# Altium project MiniHeating.PrjPcb
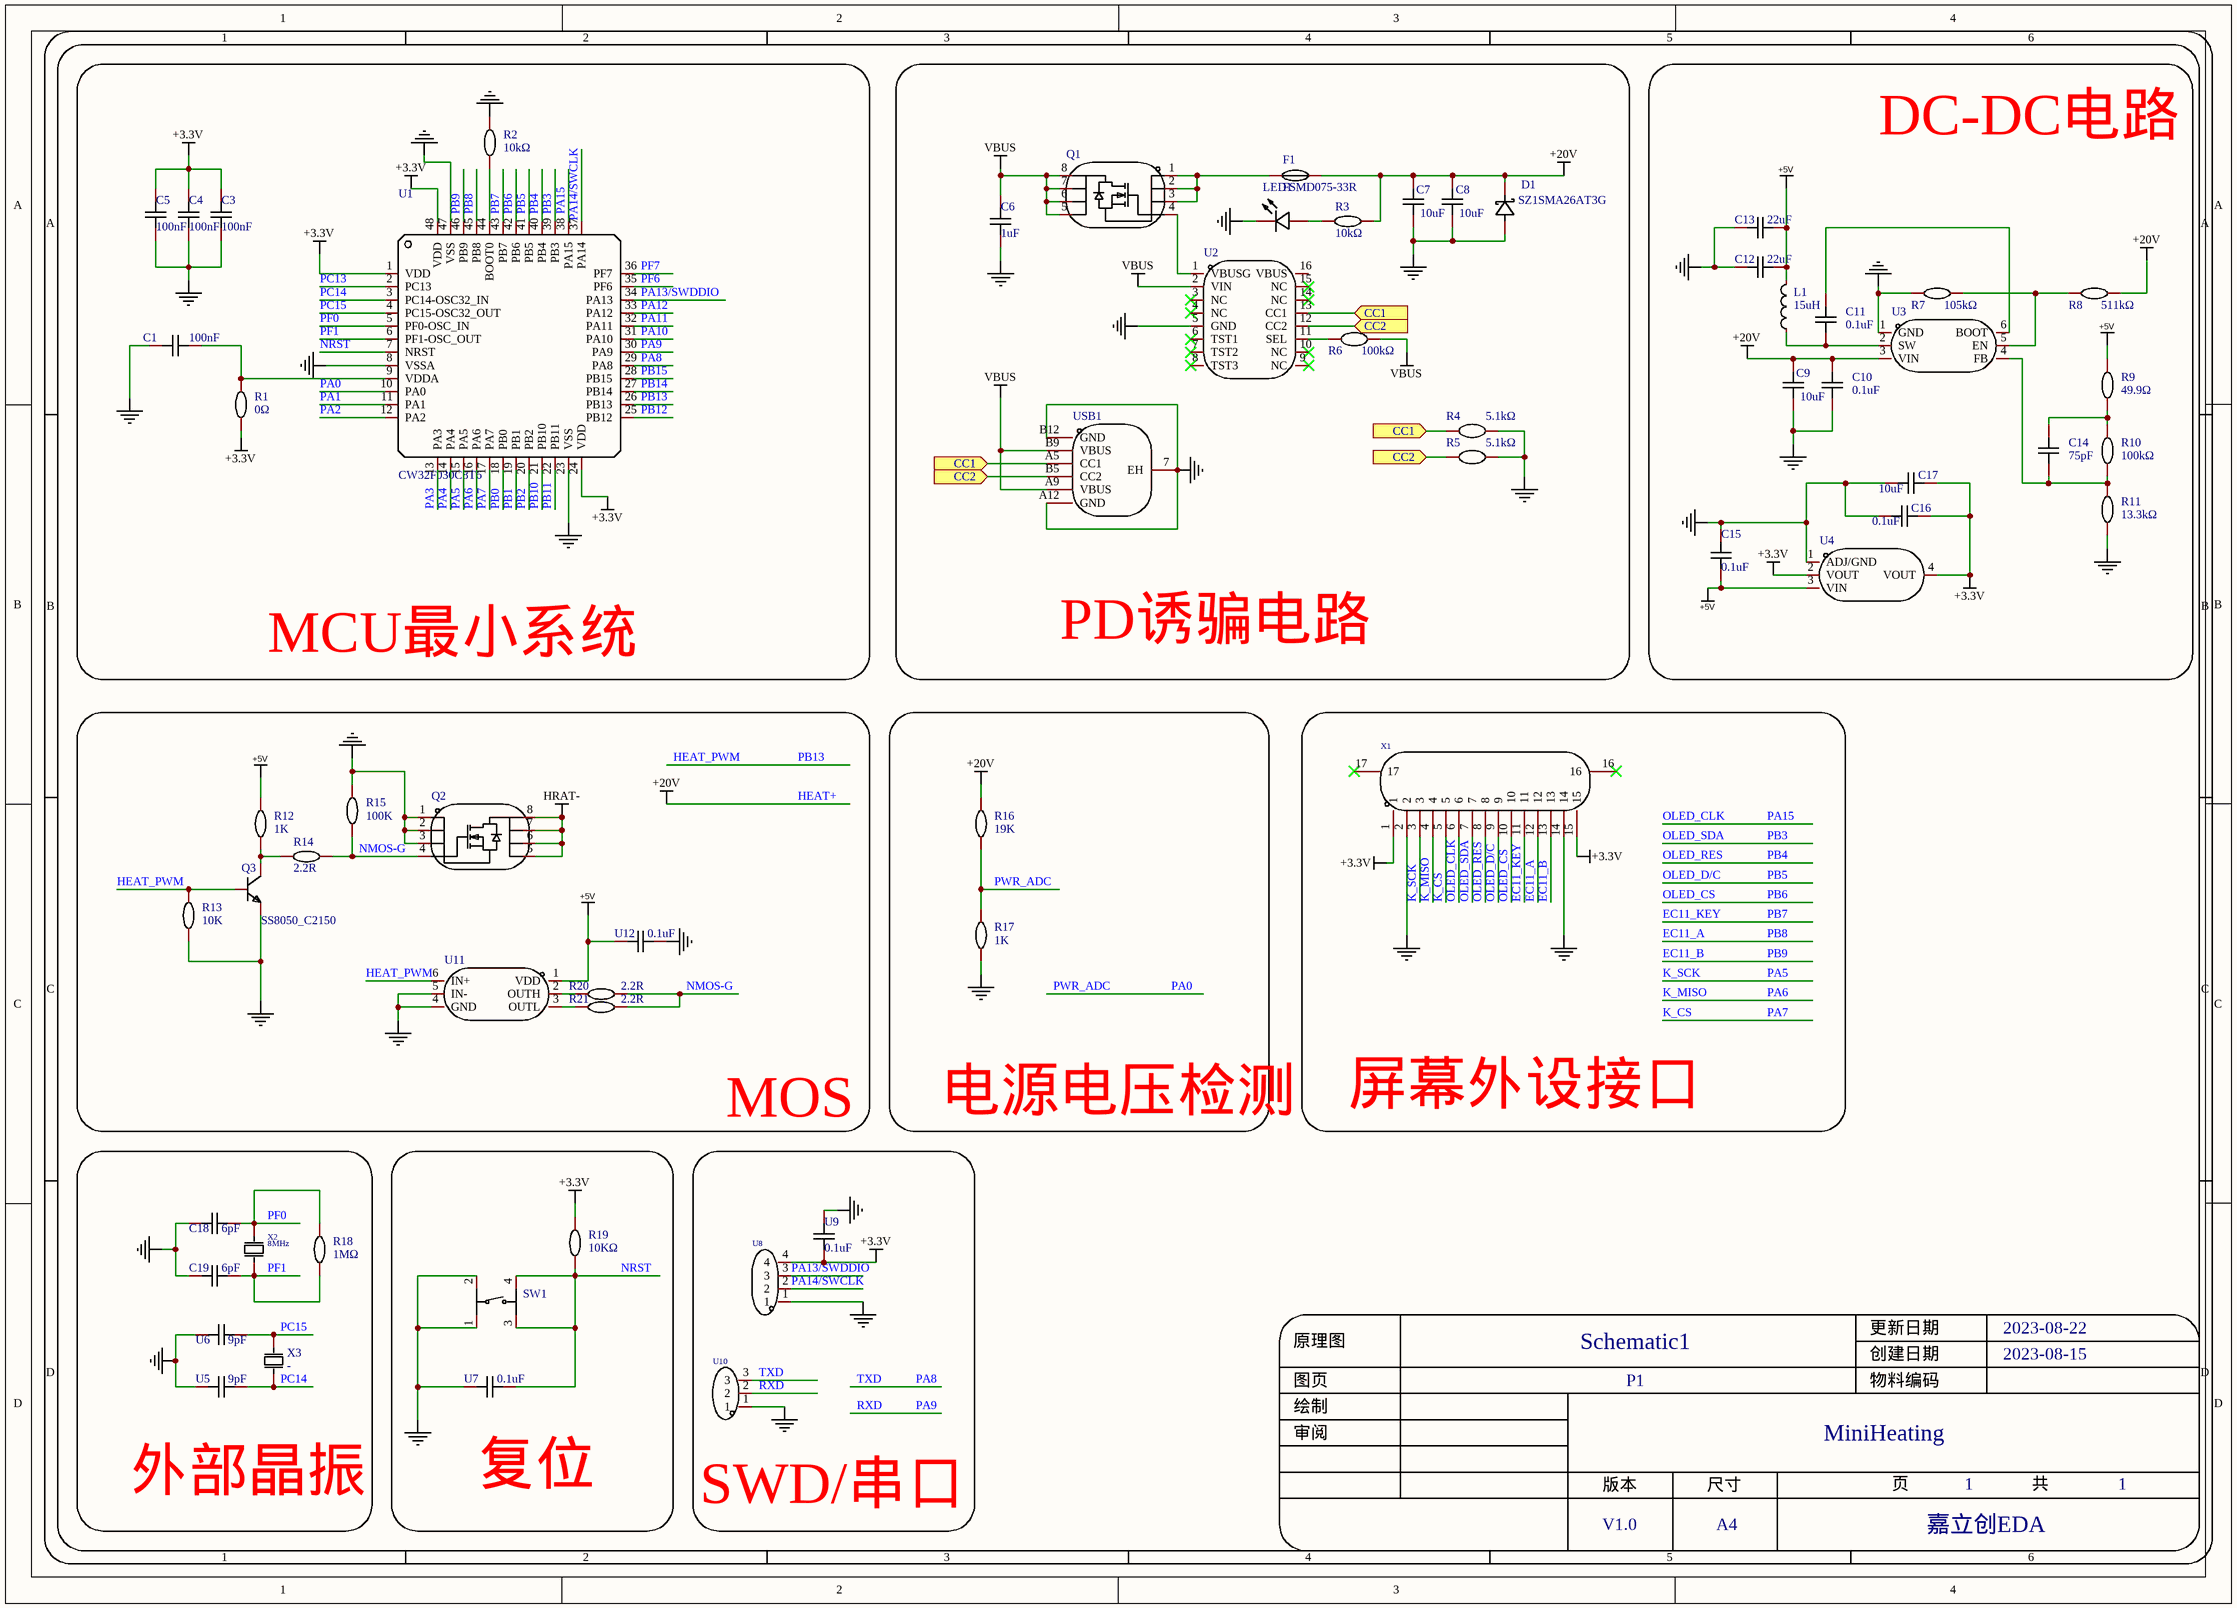
[diagram p0: MiniHeating.SchDoc]
1 sheet, 63 parts. Net scope: flat (ports and power ports of the same name join across sheets).
Board file: MiniHeating.PcbDoc

## Sheet MiniHeating.SchDoc
size 431 x 309 mm; Symbol: Sheet-Symbol_A4; Device: Sheet-Symbol_A4; @Page Name: P1; @Create Date: 2023-08-15; @Page Count: 1; @Page No: 1; @Project Name: MiniHeating; @Schematic Name: Schematic1; @Update Date: 2023-08-22; Company: 嘉立创EDA; Page Size: A4; Version: V1.0

### Parts
C1  value 100nF  [C0603]  (hidden comment: CC0603KRX7R9BB104)
C3  value 100nF  [C0603]  (hidden comment: CC0603KRX7R9BB104)
C4  value 100nF  [C0603]  (hidden comment: CC0603KRX7R9BB104)
C5  value 100nF  [C0603]  (hidden comment: CC0603KRX7R9BB104)
C6  value 1uF  [C0805]  (hidden comment: 10uF_C15415)
C7  10uF  [C0805]
C8  10uF  [C0805]
C9  10uF  [C0805]
C10  value 0.1uF  [C0603]  (hidden comment: 0603BB104K500NGT)
C11  value 0.1uF  [C0603]  (hidden comment: 0603BB104K500NGT)
C12  22uF  [C0805]
C13  22uF  [C0805]
C14  value 75pF  [C0603]  (hidden comment: 0603BB104K500NGT)
C15  value 0.1uF  [C0603]  (hidden comment: 0603BB104K500NGT)
C16  value 0.1uF  [C0603]  (hidden comment: 0603BB104K500NGT)
C17  10uF  [C0805]
C18  value 6pF  [C0603]  (hidden comment: CGA3E2C0G1H060DT0Y0N)
C19  value 6pF  [C0603]  (hidden comment: CGA3E2C0G1H060DT0Y0N)
D1  SZ1SMA26AT3G  [SMA_L4.3-W2.6-LS5.2-FD]
F1  FSMD075-33R  [F1812]
L1  value 15uH  [IND-SMD_L7.0-W6.6_FXL0630]  (hidden comment: FXL0630-150-M)
LED1  KT-0603R  [LED0603-RD]  (value not drawn)
Q1  BSC123N08NS3 G  [PG-TDSON-8_L5.0-W6.0-P1.27-BL-EP]  (value not drawn)
Q2  BSC123N08NS3 G  [PG-TDSON-8_L5.0-W6.0-P1.27-BL-EP]  (value not drawn)
Q3  SS8050_C2150  [SOT-23-3_L2.9-W1.3-P1.90-LS2.4-BR]
R1  value 0Ω  [R0603]  (hidden comment: 0603WAF4703T5E)
R2  value 10kΩ  [R0603]  (hidden comment: 0603WAF2402T5E)
R3  value 10kΩ  [R0603]  (hidden comment: RNCS0603BKE10K0)
R4  value 5.1kΩ  [R0603]  (hidden comment: AC0603DR-0710KL)
R5  value 5.1kΩ  [R0603]  (hidden comment: AC0603DR-0710KL)
R6  100kΩ  [R0603]
R7  value 105kΩ  [R0603]  (hidden comment: AC0603FR-07105KL)
R8  value 511kΩ  [R0603]  (hidden comment: AC0603FR-07105KL)
R9  value 49.9Ω  [R0603]  (hidden comment: AR03BTC5002A)
R10  value 100kΩ  [R0603]  (hidden comment: AR03BTC5002A)
R11  value 13.3kΩ  [R0603]  (hidden comment: AR03BTC5002A)
R12  value 1K  [R0603]  (hidden comment: 0603WAF4703T5E)
R13  value 10K  [R0603]  (hidden comment: 0603WAF4703T5E)
R14  value 2.2R  [R0603]  (hidden comment: 0603WAF4703T5E)
R15  value 100K  [R0603]  (hidden comment: 0603WAF4703T5E)
R16  value 19K  [R0603]  (hidden comment: 0603WAF4703T5E)
R17  value 1K  [R0603]  (hidden comment: 0603WAF4703T5E)
R18  value 1MΩ  [R0603]  (hidden comment: 0603WAF1004T5E)
R19  value 10KΩ  [R0603]  (hidden comment: 0603WAF1004T5E)
R20  value 2.2R  [R0603]  (hidden comment: 0603WAF4703T5E)
R21  value 2.2R  [R0603]  (hidden comment: 0603WAF4703T5E)
SW1  TS-1186D-C-A  [SW-SMD_TS-1186D-C-A]  (value not drawn)
U1  CW32F030C8T6  [LQFP-48_L7.0-W7.0-P0.50-LS9.0-TL]
U2  IP2721  [TSSOP-16_L5.0-W4.4-P0.65-LS6.4-BL]  (value not drawn)
U3  TPS54202DDCR  [SOT-23-6_L2.9-W1.6-P0.95-LS2.8-BL]  (value not drawn)
U4  LM1117GS-3.3  [SOT-223-3_L6.5-W3.4-P2.30-LS7.0-BR]  (value not drawn)
U5  value 9pF  [C0603]  (hidden comment: C1608C0G1H090D080AA)
U6  value 9pF  [C0603]  (hidden comment: C1608C0G1H090D080AA)
U7  value 0.1uF  [C0603]  (hidden comment: C1608C0G1H090D080AA)
U8  ZX-PZ2.54-1-4PWZ  [HDR-TH_4P-P2.54-H-M-W10.3]  (value not drawn)
U9  value 0.1uF  [C0603]  (hidden comment: C1608C0G1H090D080AA)
U10  ZX-PZ2.54-1-3PZZ  [HDR-TH_3P-P2.54-V-M-1]  (value not drawn)
U11  UCC27511DBVR  [SOT-23-6_L2.9-W1.6-P0.95-LS2.8-BL]  (value not drawn)
U12  value 0.1uF  [C0603]  (hidden comment: C1608C0G1H090D080AA)
USB1  TYPE-C-6P-DIP2X2  [TYPE-C-SMD_TYPE-C-6P]  (value not drawn)
X1  AFC01-S15FCA-00  [FPC-SMD_15P-P0.50_JS_AFC01-S15FCA-00]  (value not drawn)
X2  value 8MHz  [HC-49US_L11.5-W4.5-P4.88]  (hidden comment: TAXD8M2GLFBET2T)
X3  SF32WK32768D31T002  [OSC-SMD_L3.2-W1.5]  (value not drawn)

### Blocks framed on the sheet
MCU最小系统: C1 C3-C5 R1 R2 U1
PD诱骗电路: C6-C8 D1 F1 LED1 Q1 R3-R6 U2 USB1
DC-DC电路: C9-C17 L1 R7-R11 U3 U4
MOS: Q2 Q3 R12-R15 R20 R21 U11 U12
电源电压检测: R16 R17
屏幕外设接口: X1
外部晶振: C18 C19 R18 U5 U6 X2 X3
复位: R19 SW1 U7
SWD/串口: U8-U10

### Ports
CC1 (in), CC2 (in)

### Nets
+3.3V: C3.2 C4.2 C5.2 C16.1 C17.1 R1.1 R19.2 U1.1(VDD) U1.24(VDD) U1.48(VDD) U4.2(VOUT) U4.4(VOUT) U8.4 U9.1 X1.1 X1.15
+5V: C12.1 C13.1 C15.1 L1.2 R9.2 R12.2 U4.3(VIN) U11.1(VDD) U12.1
HEAT+: C7.2 C8.2 C9.2 C10.2 D1.2(K) F1.2 R3.1 R8.2 R16.2 U3.3(VIN)  [also labelled +20V]
HRAT-: Q2.5(D) Q2.6(D) Q2.7(D) Q2.8(D)
NetC1_1: C1.1 C3.1 C4.1 C5.1 C6.1 C7.1 C8.1 C9.1 C10.1 C12.2 C13.2 C15.2 C16.2 C17.2 C18.1 C19.1 D1.1(A) LED1.1(K) Q2.1(S) Q2.2(S) Q2.3(S) Q3.2(E) R2.2 R4.2 R5.2 R7.1 R11.1 R13.1 R15.2 R17.1 SW1.1 SW1.2 U1.8(VSSA) U1.23(VSS) U1.47(VSS) U2.5(GND) U3.1(GND) U4.1(ADJ/GND) U5.1 U6.1 U7.1 U8.1 U9.2 U10.1 U11.4(GND) U11.5(IN-) U12.2 USB1.7(EH) USB1.A12(GND) USB1.B12(GND) X1.2 X1.14
VBUS: C6.2 Q1.5(D) Q1.6(D) Q1.7(D) Q1.8(D) R6.2 U2.2(VIN) USB1.A9(VBUS) USB1.B9(VBUS)
EC11_A: U1.45(PB8) X1.12  [also labelled PB8]
EC11_B: U1.46(PB9) X1.13  [also labelled PB9]
EC11_KEY: U1.43(PB7) X1.11  [also labelled PB7]
HEAT_PWM: Q3.1(B) R13.2 U1.26(PB13) U11.6(IN+)  [also labelled PB13]
K_CS: U1.17(PA7) X1.5  [also labelled PA7]
K_MISO: U1.16(PA6) X1.4  [also labelled PA6]
K_SCK: U1.15(PA5) X1.3  [also labelled PA5]
NMOS-G: Q2.4(G) R14.1 R15.1 R20.1 R21.1
NRST: R19.1 SW1.3 SW1.4 U1.7(NRST) U7.2
OLED_CLK: U1.38(PA15) X1.6  [also labelled PA15]
OLED_CS: U1.42(PB6) X1.10  [also labelled PB6]
OLED_D/C: U1.41(PB5) X1.9  [also labelled PB5]
OLED_RES: U1.40(PB4) X1.8  [also labelled PB4]
OLED_SDA: U1.39(PB3) X1.7  [also labelled PB3]
PA0: R16.1 R17.2 U1.10(PA0)  [also labelled PWR_ADC]
PA1: U1.11(PA1)
PA2: U1.12(PA2)
PA3: U1.13(PA3)
PA4: U1.14(PA4)
PA8: U1.29(PA8) U10.3  [also labelled TXD]
PA9: U1.30(PA9) U10.2  [also labelled RXD]
PA10: U1.31(PA10)
PA11: U1.32(PA11)
PA12: U1.33(PA12)
PA13/SWDDIO: U1.34(PA13) U8.3
PA14/SWCLK: U1.37(PA14) U8.2
PB0: U1.18(PB0)
PB1: U1.19(PB1)
PB2: U1.20(PB2)
PB10: U1.21(PB10)
PB11: U1.22(PB11)
PB12: U1.25(PB12)
PB14: U1.27(PB14)
PB15: U1.28(PB15)
PC13: U1.2(PC13)
PC14: U1.3(PC14-OSC32_IN) U5.2 X3.1(OSC1)
PC15: U1.4(PC15-OSC32_OUT) U6.2 X3.2(OSC2)
PF0: C18.2 R18.2 U1.5(PF0-OSC_IN) X2.2(OSC2)
PF1: C19.2 R18.1 U1.6(PF1-OSC_OUT) X2.1(OSC1)
PF6: U1.35(PF6)
PF7: U1.36(PF7)
NetC1_2: C1.2 R1.2 U1.9(VDDA)
NetC11_1: C11.1 U3.6(BOOT)
NetC11_2: C11.2 L1.1 U3.2(SW)
NetC14_1: C14.1 R10.1 R11.2 U3.4(FB)
NetC14_2: C14.2 R9.1 R10.2
NetF1_1: F1.1 Q1.1(S) Q1.2(S) Q1.3(S)
NetLED1_2: LED1.2(A) R3.2
NetQ1_4: Q1.4(G) U2.1(VBUSG)
NetQ3_3: Q3.3(C) R12.1 R14.2
NetR2_1: R2.1 U1.44(BOOT0)
NetR4_1: R4.1 U2.13(CC1) USB1.A5(CC1) ; port CC1
NetR5_1: R5.1 U2.12(CC2) USB1.B5(CC2) ; port CC2
NetR6_1: R6.1 U2.11(SEL)
NetR7_2: R7.2 R8.1 U3.5(EN)
NetR20_2: R20.2 U11.2(OUTH)
NetR21_2: R21.2 U11.3(OUTL)

Not connected (* = marked no-connect by the designer): U2 3(NC)* 4(NC)* 6(TST1)* 7(TST2)* 8(TST3)* 9(NC)* 10(NC)* 14(NC)* 15(NC)* 16(VBUS); X1 16* 17*

### Notes on the sheet
- 1
- 2
- 3
- 4
- 5
- 6
- A
- B
- C
- D
- 原理图
- Schematic1
- 创建日期
- 更新日期
- 2023-08-15
- 2023-08-22
- 审阅
- 绘制
- 图页
- P1
- 物料编码
- MiniHeating
- 版本
- 尺寸
- 页
- 共
- V1.0
- A4
- 嘉立创EDA

### Library data of the parts
C1 C3-C5 = CC0603KRX7R9BB104: 容值:100nF;精度:±10%;额定电压:50V;材质(温度系数):X7R;; Manufacturer: YAGEO(国巨); Add into BOM: yes; Tolerance: ±10%; Voltage Rated: 50V; Temperature Coefficient: X7R; Name: 100nF; Symbol: CC0603KRX7R9BB104; Device: CC0603KRX7R9BB104; LCSC Part Name: 100nF ±10% 50V; Supplier Part: C14663; Manufacturer Part: CC0603KRX7R9BB104; Supplier Footprint: 0603; JLCPCB Part Class: 基础库; Datasheet: https://atta.szlcsc.com/upload/public/pdf/source/20180910/C282072_33301C7F631E79921B82A8DAC6BCC5B3.pdf; Supplier: LCSC; Convert to PCB: yes
C6 = 10uF_C15415: 容值:10uF;精度:±20%;额定电压:16V;材质(温度系数):-;; Manufacturer: SAMSUNG(三星); Symbol: 10UF; Add into BOM: yes; Tolerance: ±20%; Voltage Rated: 16V; Name: 1uF; Device: 10uF_C15415; LCSC Part Name: 10uF ±20% 16V; Supplier Part: C15415; Manufacturer Part: 10uF; Supplier Footprint: 0603; JLCPCB Part Class: 扩展库; Datasheet: https://atta.szlcsc.com/upload/public/pdf/source/20160103/1457707675960.pdf; Supplier: LCSC; Convert to PCB: yes; Temperature Coefficient: -
C7-C9 C12 C13 C17 = GRT21BC71E106KE13L: 容值:10uF;精度:±10%;额定电压:-;材质(温度系数):-;; Manufacturer: muRata(村田); Add into BOM: yes; Tolerance: ±10%; Symbol: GRT21BC71E106KE13L; Device: GRT21BC71E106KE13L; LCSC Part Name: 10uF ±10%; Supplier Part: C882505; Manufacturer Part: GRT21BC71E106KE13L; Supplier Footprint: 0805; JLCPCB Part Class: 扩展库; Datasheet: https://atta.szlcsc.com/upload/public/pdf/source/20201228/C882505_6C63D8D57C6472D033E3095FB59E12C2.pdf; Supplier: LCSC; Convert to PCB: yes; Voltage Rated: -; Temperature Coefficient: -
  C7-C9 C17: Name: 10uF; Value: 10uF
  C12 C13: Name: 22uF; Value: 22uF
C10 C11 C14-C16 = 0603BB104K500NGT: 容值:0.1uF;精度:±10%;额定电压:50V;温度系数:-;; Manufacturer: Knowles(楼氏); Add into BOM: yes; Tolerance: ±10%; Voltage Rated: 50V; Symbol: 0603BB104K500NGT; Device: 0603BB104K500NGT; LCSC Part Name: 0.1uF ±10% 50V; Supplier Part: C2168571; Manufacturer Part: 0603BB104K500NGT; Supplier Footprint: 0603; JLCPCB Part Class: 扩展库; Datasheet: https://atta.szlcsc.com/upload/public/pdf/source/20210426/55B82DB4A9EC19DEFEE13887341FCC08.pdf; Supplier: LCSC; Convert to PCB: yes; Temperature Coefficient: -
  C10 C11 C15 C16: Name: 0.1uF
  C14: Name: 75pF
C18 C19 = CGA3E2C0G1H060DT0Y0N: 容值:6pF;额定电压:50V;材质(温度系数):C0G;; Manufacturer: TDK; Add into BOM: yes; Voltage Rated: 50V; Temperature Coefficient: C0G; Name: 6pF; Symbol: CGA3E2C0G1H060DT0Y0N; Device: CGA3E2C0G1H060DT0Y0N; LCSC Part Name: 6pF 50V ±0.5pF; Supplier Part: C694219; Manufacturer Part: CGA3E2C0G1H060DT0Y0N; Supplier Footprint: 0603; JLCPCB Part Class: 扩展库; Datasheet: https://atta.szlcsc.com/upload/public/pdf/source/20200407/C342960_6CC453447A835E749A2F3B1A914A9616.pdf; Supplier: LCSC; Convert to PCB: yes
D1 = SZ1SMA26AT3G: Manufacturer: Littelfuse(美国力特); Add into BOM: yes; Name: SZ1SMA26AT3G; Symbol: SZ1SMA26AT3G; Device: SZ1SMA26AT3G; LCSC Part Name: SZ1SMA26AT3G; Supplier Part: C1975457; Manufacturer Part: SZ1SMA26AT3G; Supplier Footprint: SMA; JLCPCB Part Class: 扩展库; Datasheet: https://atta.szlcsc.com/upload/public/pdf/source/20210601/15337EED7CF3C342084442CB99DEBA14.pdf; Supplier: LCSC; Convert to PCB: yes
F1 = FSMD075-33R: 最大电压:33V;最大电流:40A;保持电流:750mA;跳闸电流:1.5A;; Manufacturer: FUZETEC(台湾富致); Add into BOM: yes; Operating Voltage (Max): 33V; Current Rating (Max): 40A; Hold Current: 750mA; Trip Current: 1.5A; Name: FSMD075-33R; Symbol: FSMD075-33R; Device: FSMD075-33R; LCSC Part Name: 0.75A  33V 自恢复保险丝; Supplier Part: C220153; Manufacturer Part: FSMD075-33R; Supplier Footprint: 1812; JLCPCB Part Class: 扩展库; Datasheet: https://atta.szlcsc.com/upload/public/pdf/source/20180530/C220153_A5440436DCCE76D7B09FFA7742F63C0D.pdf; Supplier: LCSC; Convert to PCB: yes
L1 = FXL0630-150-M: 电感值:15uH;精度:±20%;额定电流:3A;饱和电流(Isat):4.5A;; Manufacturer: cjiang(长江微电); Add into BOM: yes; Tolerance: ±20%; Rated Current: 3A; Saturation Current (Isat): 4.5A; DC Resistance (DCR): 104mΩ; Name: 15uH; Symbol: FXL0630-150-M; Device: FXL0630-150-M; LCSC Part Name: 15uH ±20% 3A 104mΩ; Supplier Part: C177243; Manufacturer Part: FXL0630-150-M; Supplier Footprint: SMD,6.6x7mm; Datasheet: https://atta.szlcsc.com/upload/public/pdf/source/20190322/C177243_004B47DCE1D3E0A12FACEEA4F4ACE71C.pdf; Supplier: LCSC; Convert to PCB: yes
LED1 = KT-0603R: 发光颜色:红灯;二极管配置:-;透镜颜色:-;主波长:-;色温:-;功率:-;发光角度:-;安装方式:-;工作温度:-40℃~+85℃;; Manufacturer: KENTO; Add into BOM: yes; Emitted Color: 红灯; Name: KT-0603R; Symbol: KT-0603R; Device: KT-0603R; LCSC Part Name: 0603 红灯 高亮; Supplier Part: C2286; Manufacturer Part: KT-0603R; Supplier Footprint: 0603; JLCPCB Part Class: 基础库; Datasheet: https://atta.szlcsc.com/upload/public/pdf/source/20160616/1466072038404.pdf; Supplier: LCSC; Convert to PCB: yes; Diode Configuration: -; Lens Color: -; Dominant Wavelength: -; Peak Wavelength: -; Color Temperature: -; Forward Current: -; Power Dissipation: -; Viewing Angle: -; Mounting Sytle: -; Operating Temperature: -40℃~+85℃
Q1 Q2 = BSC123N08NS3 G: Add into BOM: yes; Name: BSC123N08NS3 G; Symbol: BSC123N08NS3 G; Device: BSC123N08NS3 G; LCSC Part Name: BSC123N08NS3 G; Supplier Part: C534413; Manufacturer Part: BSC123N08NS3 G; Supplier Footprint: PG-TDSON-8; JLCPCB Part Class: 扩展库; Datasheet: https://atta.szlcsc.com/upload/public/pdf/source/20190819/C412732_804FABEBD1A1A36C7ECAA379DC5AE4F1.pdf; Supplier: LCSC; Convert to PCB: yes
Q3 = SS8050_C2150: 晶体管类型:NPN;集射极击穿电压(Vceo):25V;集电极电流(Ic):1.5A;功率(Pd):300mW;直流电流增益(hFE@Ic,Vce):200@100mA,1V;; Manufacturer: CJ(江苏长电/长晶); Name: SS8050; Add into BOM: yes; Transistor Type: NPN; Collector-Emitter Breakdown Voltage (Vceo): 25V; Collector Current (Ic): 1.5A; Power Dissipation (Pd): 300mW; Collector Cut-Off Current (Icbo): 100nA; Collector-Emitter Saturation Voltage (VCE(sat)@Ic,Ib): 500mV@800mA,80mA; Transition Frequency (fT): 100MHz; Symbol: SS8050_C2150; Device: SS8050_C2150; LCSC Part Name: NPN 25V 1.5A Y1 200-350; Supplier Part: C2150; Manufacturer Part: SS8050; Supplier Footprint: SOT-23; JLCPCB Part Class: 基础库; Datasheet: https://atta.szlcsc.com/upload/public/pdf/source/20230322/AEE86F4B043774EFF80CAEA14A37D9E9.pdf; Supplier: LCSC; Convert to PCB: yes; DC Current Gain (hFE@Ic,Vce): 200@100mA,1V; Operating Temperature: +150℃@(Tj)
R1 R12-R17 R20 R21 = 0603WAF4703T5E: 电阻类型:厚膜电阻;阻值:470kΩ;精度:±1%;功率:100mW;; Manufacturer: UNI-ROYAL(厚声); Add into BOM: yes; Tolerance: ±1%; Power(Watts): 100mW; Temperature Coefficient: ±100ppm/℃; Overload Voltage (Max): 75V; Symbol: 0603WAF4703T5E; Device: 0603WAF4703T5E; LCSC Part Name: 470kΩ ±1% 100mW; Supplier Part: C23178; Manufacturer Part: 0603WAF4703T5E; Supplier Footprint: 0603; JLCPCB Part Class: 基础库; Datasheet: https://atta.szlcsc.com/upload/public/pdf/source/20200306/C422600_1E6D84923E4A46A82E41ADD87F860B5C.pdf; Supplier: LCSC; Convert to PCB: yes; Type: 厚膜电阻; Operating Temperature Range: -55℃~+155℃
  R1: Name: 0Ω
  R12 R17: Name: 1K
  R13: Name: 10K
  R14 R20 R21: Name: 2.2R
  R15: Name: 100K
  R16: Name: 19K
R2 = 0603WAF2402T5E: 电阻类型:厚膜电阻;阻值:24kΩ;精度:±1%;功率:100mW;; Manufacturer: UNI-ROYAL(厚声); Add into BOM: yes; Tolerance: ±1%; Power(Watts): 100mW; Temperature Coefficient: ±100ppm/℃; Overload Voltage (Max): 75V; Name: 10kΩ; Symbol: 0603WAF2402T5E; Device: 0603WAF2402T5E; LCSC Part Name: 24kΩ ±1% 100mW; Supplier Part: C23352; Manufacturer Part: 0603WAF2402T5E; Supplier Footprint: 0603; JLCPCB Part Class: 基础库; Datasheet: https://atta.szlcsc.com/upload/public/pdf/source/20200306/C422600_1E6D84923E4A46A82E41ADD87F860B5C.pdf; Supplier: LCSC; Convert to PCB: yes; Type: 厚膜电阻; Operating Temperature Range: -55℃~+155℃
R3 = RNCS0603BKE10K0: 电阻类型:薄膜电阻;阻值:10kΩ;精度:±0.1%;功率:63mW;; Manufacturer: SEI(Stackpole Electronics Inc.); Add into BOM: yes; Tolerance: ±0.1%; Power(Watts): 63mW; Temperature Coefficient: ±25ppm/℃; Overload Voltage (Max): 50V; Name: 10kΩ; Symbol: RNCS0603BKE10K0; Device: RNCS0603BKE10K0; LCSC Part Name: 10kΩ ±0.1% 63mW; Supplier Part: C346660; Manufacturer Part: RNCS0603BKE10K0; Supplier Footprint: 0603; JLCPCB Part Class: 扩展库; Datasheet: https://atta.szlcsc.com/upload/public/pdf/source/20190312/C346660_6593869450E2ACFE6B08A39759115977.pdf; Supplier: LCSC; Convert to PCB: yes; Type: 薄膜电阻; Operating Temperature Range: -55℃~+155℃
R4 R5 = AC0603DR-0710KL: 电阻类型:厚膜电阻;阻值:10kΩ;精度:±0.5%;功率:100mW;; Manufacturer: YAGEO(国巨); Add into BOM: yes; Tolerance: ±0.5%; Power(Watts): 100mW; Temperature Coefficient: ±100ppm/℃; Overload Voltage (Max): 75V; Name: 5.1kΩ; Symbol: AC0603DR-0710KL; Device: AC0603DR-0710KL; LCSC Part Name: 10kΩ ±0.5% 100mW; Supplier Part: C227439; Manufacturer Part: AC0603DR-0710KL; Supplier Footprint: 0603; JLCPCB Part Class: 扩展库; Datasheet: https://atta.szlcsc.com/upload/public/pdf/source/20191108/C227439_3520A6C2771953E8CF7D95F8889FB444.pdf; Supplier: LCSC; Convert to PCB: yes; Type: 厚膜电阻; Operating Temperature Range: -55℃~+155℃
R6 = HoLTT0805-1/8W-100K-5%: 阻值:100kΩ;功率:125mW;; Manufacturer: Milliohm(毫欧); Add into BOM: yes; Power(Watts): 125mW; Name: 100kΩ; Symbol: HOLTT0805-1/8W-100K-5%; Device: HoLTT0805-1/8W-100K-5%; LCSC Part Name: 100kΩ 125mW; Supplier Part: C2904540; Manufacturer Part: HoLTT0805-1/8W-100K-5%; Supplier Footprint: 0805; JLCPCB Part Class: 扩展库; Datasheet: https://atta.szlcsc.com/upload/public/pdf/source/20211021/528351F376078D6228C985A842C3763C.pdf; Supplier: LCSC; Convert to PCB: yes; Value: 100kΩ
R7 R8 = AC0603FR-07105KL: 电阻类型:厚膜电阻;阻值:105kΩ;精度:±1%;功率:100mW;; Manufacturer: YAGEO(国巨); Add into BOM: yes; Tolerance: ±1%; Power(Watts): 100mW; Temperature Coefficient: ±100ppm/℃; Overload Voltage (Max): 75V; Symbol: AC0603FR-07105KL; Device: AC0603FR-07105KL; LCSC Part Name: 105kΩ ±1% 100mW; Supplier Part: C227540; Manufacturer Part: AC0603FR-07105KL; Supplier Footprint: 0603; JLCPCB Part Class: 扩展库; Datasheet: https://atta.szlcsc.com/upload/public/pdf/source/20180927/C227540_3E88CBC2D860AFE35B2DA2E929FA8B64.pdf; Supplier: LCSC; Convert to PCB: yes; Type: 厚膜电阻; Operating Temperature Range: -55℃~+155℃
  R7: Name: 105kΩ
  R8: Name: 511kΩ
R9-R11 = AR03BTC5002A: 阻值:50kΩ;精度:±0.1%;功率:62.5mW;; Manufacturer: Viking(光颉); Add into BOM: yes; Tolerance: ±0.1%; Power(Watts): 62.5mW; Temperature Coefficient: ±25ppm/℃; Symbol: AR03BTC5002A; Device: AR03BTC5002A; LCSC Part Name: 50kΩ ±0.1% 62.5mW; Supplier Part: C304067; Manufacturer Part: AR03BTC5002A; Supplier Footprint: 0603; JLCPCB Part Class: 扩展库; Datasheet: https://atta.szlcsc.com/upload/public/pdf/source/20180929/C304067_C6C1AA1A73175DF88A934A2863C540D5.pdf; Supplier: LCSC; Convert to PCB: yes
  R9: Name: 49.9Ω
  R10: Name: 100kΩ
  R11: Name: 13.3kΩ
R18 R19 = 0603WAF1004T5E: 电阻类型:厚膜电阻;阻值:1MΩ;精度:±1%;功率:100mW;; Manufacturer: UNI-ROYAL(厚声); Add into BOM: yes; Tolerance: ±1%; Power(Watts): 100mW; Temperature Coefficient: ±100ppm/℃; Overload Voltage (Max): 75V; Symbol: 0603WAF1004T5E; Device: 0603WAF1004T5E; LCSC Part Name: 1MΩ ±1% 100mW; Supplier Part: C22935; Manufacturer Part: 0603WAF1004T5E; Supplier Footprint: 0603; JLCPCB Part Class: 基础库; Datasheet: https://atta.szlcsc.com/upload/public/pdf/source/20200306/C422600_1E6D84923E4A46A82E41ADD87F860B5C.pdf; Supplier: LCSC; Convert to PCB: yes; Type: 厚膜电阻; Operating Temperature Range: -55℃~+155℃
  R18: Name: 1MΩ
  R19: Name: 10KΩ
SW1 = TS-1186D-C-A: 触点电流:50mA;额定电压(DC):12V;绝缘电阻:-;电路结构:单刀单掷;安装方式:卧贴;带灯:无;作用力:260gf;机械寿命:10万次;带支架:否;; Manufacturer: XKB Connectivity(中国星坤); Add into BOM: yes; Contact Current: 50mA; Voltage Rating (DC): 12V; Circuit: 单刀单掷; Actuator Style: 矩形按钮; Actuator/Cap Color: 黑色; With Lamp: 无; Operating Force: 260gf; Mechanical Life: 10万次; Switch Length: 4.7mm; Switch Width: 3.5mm; Switch Height: 1.65mm; Strike Gundam: 否; Name: TS-1186D-C-A; Symbol: TS-1186D-C-A; Device: TS-1186D-C-A; LCSC Part Name: 4.7*3.5*1.65mm 卧贴 轻触开关; Supplier Part: C397351; Manufacturer Part: TS-1186D-C-A; Supplier Footprint: SMD; JLCPCB Part Class: 扩展库; Datasheet: https://atta.szlcsc.com/upload/public/pdf/source/20211011/5C3821FFA1ADEB0B4EDA3F6C971799E5.pdf; Supplier: LCSC; Convert to PCB: yes; Insulation Resistance: -; Mounting Style: 卧贴; Operating Temperature: -30℃~+85℃
U1 = CW32F030C8T6_C3019113: CPU内核:ARM Cortex-M0+;CPU最大主频:64MHz;工作电压范围:1.65V~5.5V;内部振荡器:有;外部时钟频率范围:4MHz~32MHz;程序 FLASH容量:-;RAM总容量:8KB;EEPROM/数据 FLASH容量:-;GPIO端口数量:39;ADC(单元数/通道数/位数):1@x16ch/12bit;DAC(单元数/通道数/位数):-;(E)PWM(单元数/通道数/位数):-;8位Timer数量:-;16位Timer数量:8;32位Timer数量:-;内部比较器数量:2;U; Manufacturer: CW(芯源); Add into BOM: yes; Maximum Frequency: 64MHz; Internal Oscillator: 有; RAM Size: 8KB; GPIO Ports Number: 39; 16Bit Timer Number: 8; CMP Number: 2; U(S)ART Number: 3; Peripherals / Functions / Protocol Stacks: 片载温度传感器；DMA；看门狗；低电压检测；CRC校验; Name: CW32F030C8T6; Symbol: CW32F030C8T6_C3019113; Device: CW32F030C8T6_C3019113; LCSC Part Name: ARM Cortex-M0+ 64MHz RAM：8KB; Supplier Part: C3019113; Manufacturer Part: CW32F030C8T6; Supplier Footprint: LQFP-48; JLCPCB Part Class: 扩展库; Datasheet: https://atta.szlcsc.com/upload/public/pdf/source/20220516/D60F5E1023A73FFF550D4A77416DDFBC.pdf; Supplier: LCSC; Convert to PCB: yes; CPU Core: ARM Cortex-M0+; Supply Voltage Range: 1.65V~5.5V; External Clock Frequency Rang: 4MHz~32MHz; Program FLASH Size: -; EEPROM/Data FLASH Size: -; ADC (Units/Channels/bits): 1@x16ch/12bit; DAC (Units/Channels/bits): -; (E)PWM (Units/Channels/bits): -; 8Bit Timer Number: -; 32Bit Timer Number: -; I2C Number: 2; I2S Number: -; (Q)SPI Number: 2; CAN Number: -; USB (H/D/OTG): -; Operating Temperature Range: -40℃~105℃
U2 = IP2721: Manufacturer: INJOINIC(英集芯); Add into BOM: yes; Name: IP2721; Symbol: IP2721; Device: IP2721; LCSC Part Name: IP2721; Supplier Part: C603176; Manufacturer Part: IP2721; Supplier Footprint: TSSOP-16; JLCPCB Part Class: 扩展库; Datasheet: https://atta.szlcsc.com/upload/public/pdf/source/20200610/C603176_729C2C55A9E6451BDA9FCB913350E23E.pdf; Supplier: LCSC; Convert to PCB: yes
U3 = TPS54202DDCR: 可输出电流:2A;开关工作频率:500kHz;输出类型:Adjustable;输出电压的路数:1;功能类型:Step-Down;输出配置:Positive;; Manufacturer: TI(德州仪器); Add into BOM: yes; Name: TPS54202DDCR; Symbol: TPS54202DDCR; Device: TPS54202DDCR; LCSC Part Name: TPS54202DDCR; Supplier Part: C191884; Manufacturer Part: TPS54202DDCR; Supplier Footprint: SOT-23-6; JLCPCB Part Class: 扩展库; Datasheet: https://atta.szlcsc.com/upload/public/pdf/source/20181012/C191884_C6DBFD980275651BD8C8F427C2E48058.pdf; Supplier: LCSC; Convert to PCB: yes
U4 = LM1117GS-3.3: 输出类型:-;; Manufacturer: HTC; Add into BOM: yes; Name: LM1117GS-3.3; Symbol: LM1117GS-3.3; Device: LM1117GS-3.3; LCSC Part Name: LM1117GS-3.3; Supplier Part: C411821; Manufacturer Part: LM1117GS-3.3; Supplier Footprint: SOT-223-3L; JLCPCB Part Class: 扩展库; Datasheet: https://atta.szlcsc.com/upload/public/pdf/source/20190812/C411821_A308769BCE0BA93BFC9B436A1188CB96.pdf; Supplier: LCSC; Convert to PCB: yes; Output Type: -
U5-U7 U9 U12 = C1608C0G1H090D080AA: 容值:9pF;额定电压:50V;材质(温度系数):C0G;; Manufacturer: TDK; Add into BOM: yes; Voltage Rated: 50V; Temperature Coefficient: C0G; Symbol: C1608C0G1H090D080AA; Device: C1608C0G1H090D080AA; LCSC Part Name: 9pF 50V ±0.5pF; Supplier Part: C3869779; Manufacturer Part: C1608C0G1H090D080AA; Supplier Footprint: -; JLCPCB Part Class: 扩展库; Supplier: LCSC; Convert to PCB: yes
  U5 U6: Name: 9pF
  U7 U9 U12: Name: 0.1uF
U8 = ZX-PZ2.54-1-4PWZ: 排数:单排;总PIN位数:4P;间距:2.54mm;插针结构:1x4P;行距:-;安装类型:弯插;圆针/方针:方针;额定电流:3A;额定电压:1kV;配合针长度:6mm;塑高:2.5mm;端接针长度:3mm;触头材质:黄铜;触头镀层:金;工作温度范围:-40℃~+105℃;焊接温度(最大值):260℃@5s;颜色:黑色;; Manufacturer: Megastar(兆星); Add into BOM: yes; Pitch: 2.54mm; Pin Structure: 1x4P; Circluar Pins/Square Pins: 方针; Current Rating (Max): 3A; Voltage Rating (Max): 1kV; Name: ZX-PZ2.54-1-4PWZ; Symbol: ZX-PZ2.54-1-4PWZ; Device: ZX-PZ2.54-1-4PWZ; LCSC Part Name: 间距:2.54mm 1x4P 弯插 方针; Supplier Part: C7501292; Manufacturer Part: ZX-PZ2.54-1-4PWZ; Supplier Footprint: 插件,P=2.54mm; Datasheet: https://atta.szlcsc.com/upload/public/pdf/source/20230809/FBF6E7ECDA2AF16883A7905291890D5A.pdf; Supplier: LCSC; Convert to PCB: yes; Number of Rows: 单排; Number of Pins: 4P; Row Spacing: -; Mounting Type: 弯插; Length of Mating Pin: 6mm; Insulation Height: 2.5mm; Length of End Connection Pin: 3mm; Contact Material: 黄铜; Contact Plating: 金; Operating Temperature Range: -40℃~+105℃; Welding Temperature (Max): 260℃@5s; Color: 黑色
U10 = ZX-PZ2.54-1-3PZZ: 排数:单排;总PIN位数:3P;间距:2.54mm;插针结构:1x3P;行距:-;安装类型:直插;圆针/方针:方针;额定电流:3A;额定电压:1kV;配合针长度:6mm;塑高:2.5mm;端接针长度:3mm;触头材质:黄铜;触头镀层:金;工作温度范围:-40℃~+105℃;焊接温度(最大值):260℃@5s;颜色:黑色;; Manufacturer: Megastar(兆星); Add into BOM: yes; Pitch: 2.54mm; Pin Structure: 1x3P; Circluar Pins/Square Pins: 方针; Current Rating (Max): 3A; Voltage Rating (Max): 1kV; Name: ZX-PZ2.54-1-3PZZ; Symbol: ZX-PZ2.54-1-3PZZ; Device: ZX-PZ2.54-1-3PZZ; LCSC Part Name: 间距:2.54mm 1x3P 直插 方针; Supplier Part: C7501261; Manufacturer Part: ZX-PZ2.54-1-3PZZ; Supplier Footprint: 插件,P=2.54mm; Datasheet: https://atta.szlcsc.com/upload/public/pdf/source/20230809/0D7BA3467C1E438B377BA6DF4504DBFF.pdf; Supplier: LCSC; Convert to PCB: yes; Number of Rows: 单排; Number of Pins: 3P; Row Spacing: -; Mounting Type: 直插; Length of Mating Pin: 6mm; Insulation Height: 2.5mm; Length of End Connection Pin: 3mm; Contact Material: 黄铜; Contact Plating: 金; Operating Temperature Range: -40℃~+105℃; Welding Temperature (Max): 260℃@5s; Color: 黑色
U11 = UCC27511DBVR: 驱动配置:低边;负载类型:MOSFET；IGBT;电源电压:4.5V~18V;峰值灌电流:8A;峰值拉电流:4A;; Manufacturer: TI(德州仪器); Add into BOM: yes; Driven Configuration: 低边; Number of Drivers: 1; Peak Output Current(sink): 8A; Peak Output Current(source): 4A; Rise Time: 8ns; Fall Time: 7ns; Name: UCC27511DBVR; Symbol: UCC27511DBVR; Device: UCC27511DBVR; LCSC Part Name: 低边 IGBT MOSFET 灌:8A 拉:4A; Supplier Part: C191027; Manufacturer Part: UCC27511DBVR; Supplier Footprint: SOT-23-6; JLCPCB Part Class: 扩展库; Datasheet: https://atta.szlcsc.com/upload/public/pdf/source/20180410/C191027_1F791D2EA16D7D9F29E7AA3A1B67C631.pdf; Supplier: LCSC; Convert to PCB: yes; Load Type: MOSFET；IGBT; Supply Voltage: 4.5V~18V; Operating Temperature: -40℃~+140℃@(Tj)
USB1 = TYPE-C-6P-DIP2X2: Add into BOM: yes; Name: TYPE-C-6P-DIP2X2; Symbol: TYPE-C-6P-DIP2X2; Device: TYPE-C-6P-DIP2X2; LCSC Part Name: TYPE-C-6P-DIP2X2; Supplier Part: C9900017627; Manufacturer Part: TYPE-C-6P-DIP2X2; Supplier Footprint: TYPE-C-6P; JLCPCB Part Class: 扩展库; Datasheet: https://atta.szlcsc.comnull; Supplier: LCSC; Convert to PCB: yes
X1 = AFC01-S15FCA-00: 间距:0.5mm;触点数量:15;锁定特性:翻盖式;安装类型:卧贴;触点类型:下接;工作温度范围:-;; Manufacturer: JS(钜硕电子); Add into BOM: yes; Pitch: 0.5mm; Number of Contacts: 15; Locking Feature: 翻盖式; FFC, FCB Thickness: 0.3mm~0.3mm; Name: AFC01-S15FCA-00; Symbol: AFC01-S15FCA-00; Device: AFC01-S15FCA-00; LCSC Part Name: 15P 间距0.5mm; Supplier Part: C262664; Manufacturer Part: AFC01-S15FCA-00; Supplier Footprint: SMD,P=0.5mm; Supplier: LCSC; Convert to PCB: yes; Mounting Type: 卧贴; Contact Type: 下接; Height Above Board: 2mm; Operating Temperature Range: -
X2 = TAXD8M2GLFBET2T: 频率:8MHz;频率公差:±30ppm;负载电容:20pF;; Manufacturer: TAE(雅晶鑫); Symbol: HC-49S 8MHz 20pF 30PPM; Add into BOM: yes; Crystal Type: 49S晶振; Frequency Tolerance: ±30ppm; Load Capacitance: 20pF; Equivalent Series Resistance (ESR): 80Ω; Name: 8MHz; Device: TAXD8M2GLFBET2T; LCSC Part Name: 8MHz ±30ppm 20pF; Supplier Part: C107425; Manufacturer Part: TAXD8M2GLFBET2T; Supplier Footprint: HC-49S; JLCPCB Part Class: 扩展库; Datasheet: https://atta.szlcsc.com/upload/public/pdf/source/20170914/C127676_1505359415156967690.pdf; Supplier: LCSC; Convert to PCB: yes; Frequency Stability: ±30ppm; Operating Temperature: -
X3 = SF32WK32768D31T002: 频率:-;负载电容:-;; Manufacturer: TKD(泰晶); Symbol: SF32K32768D31T-12.5; Add into BOM: yes; Name: -; Device: SF32WK32768D31T002; LCSC Part Name: 3215  32.768k  12.5PF  20PPM  -40 -85℃; Supplier Part: C271654; Manufacturer Part: SF32WK32768D31T002; Supplier Footprint: SMD3215-2P; JLCPCB Part Class: 扩展库; Datasheet: https://atta.szlcsc.com/upload/public/pdf/source/20210414/C271654_9FD726E46D0A9E6DACC0E569C8E3A63B.pdf; Supplier: LCSC; Convert to PCB: yes; Crystal Type: -; Value: -; Load Capacitance: -; Operating Temperature: -